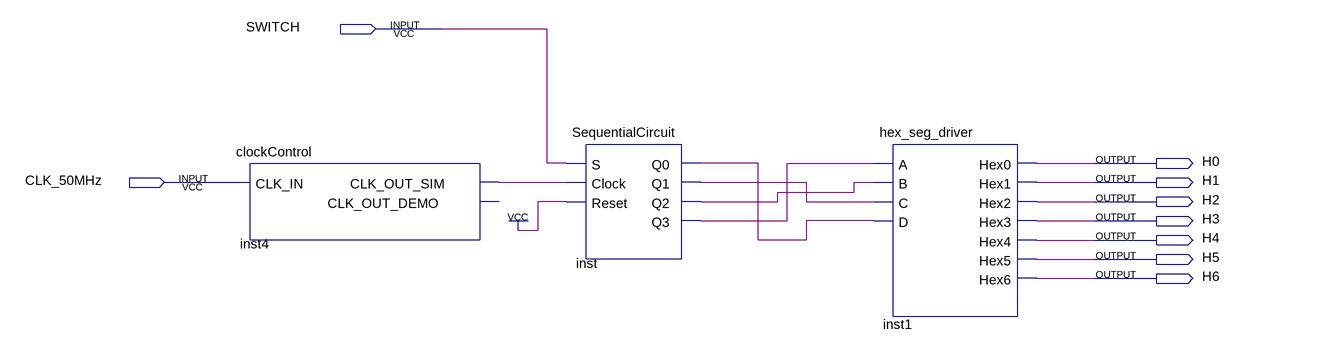
[diagram p0: schematic sheet]
// Quartus schematic FullLabFile.bdf as structural Verilog: 3 symbols, 9 pins
module FullLabFile (
  input  SWITCH,
  input  CLK_50MHz,
  output H0,
  output H1,
  output H2,
  output H3,
  output H4,
  output H5,
  output H6
);

  wire inst4_clk_out_sim, inst_q0, inst_q1, inst_q2, inst_q3;

  clockControl inst4 (.CLK_IN(CLK_50MHz), .CLK_OUT_SIM(inst4_clk_out_sim));  // open: CLK_OUT_DEMO
  SequentialCircuit inst (
    .S(SWITCH), .Clock(inst4_clk_out_sim), .Reset(1'b1), .Q0(inst_q0), .Q1(inst_q1), .Q2(inst_q2),
    .Q3(inst_q3));
  hex_seg_driver inst1 (
    .A(inst_q3), .B(inst_q2), .C(inst_q1), .D(inst_q0), .Hex0(H0), .Hex1(H1), .Hex2(H2), .Hex3(H3),
    .Hex4(H4), .Hex5(H5), .Hex6(H6));
endmodule
